# Altium schematic sheet Передатчик_2026-06-06.schdoc
size 391 x 151 mm
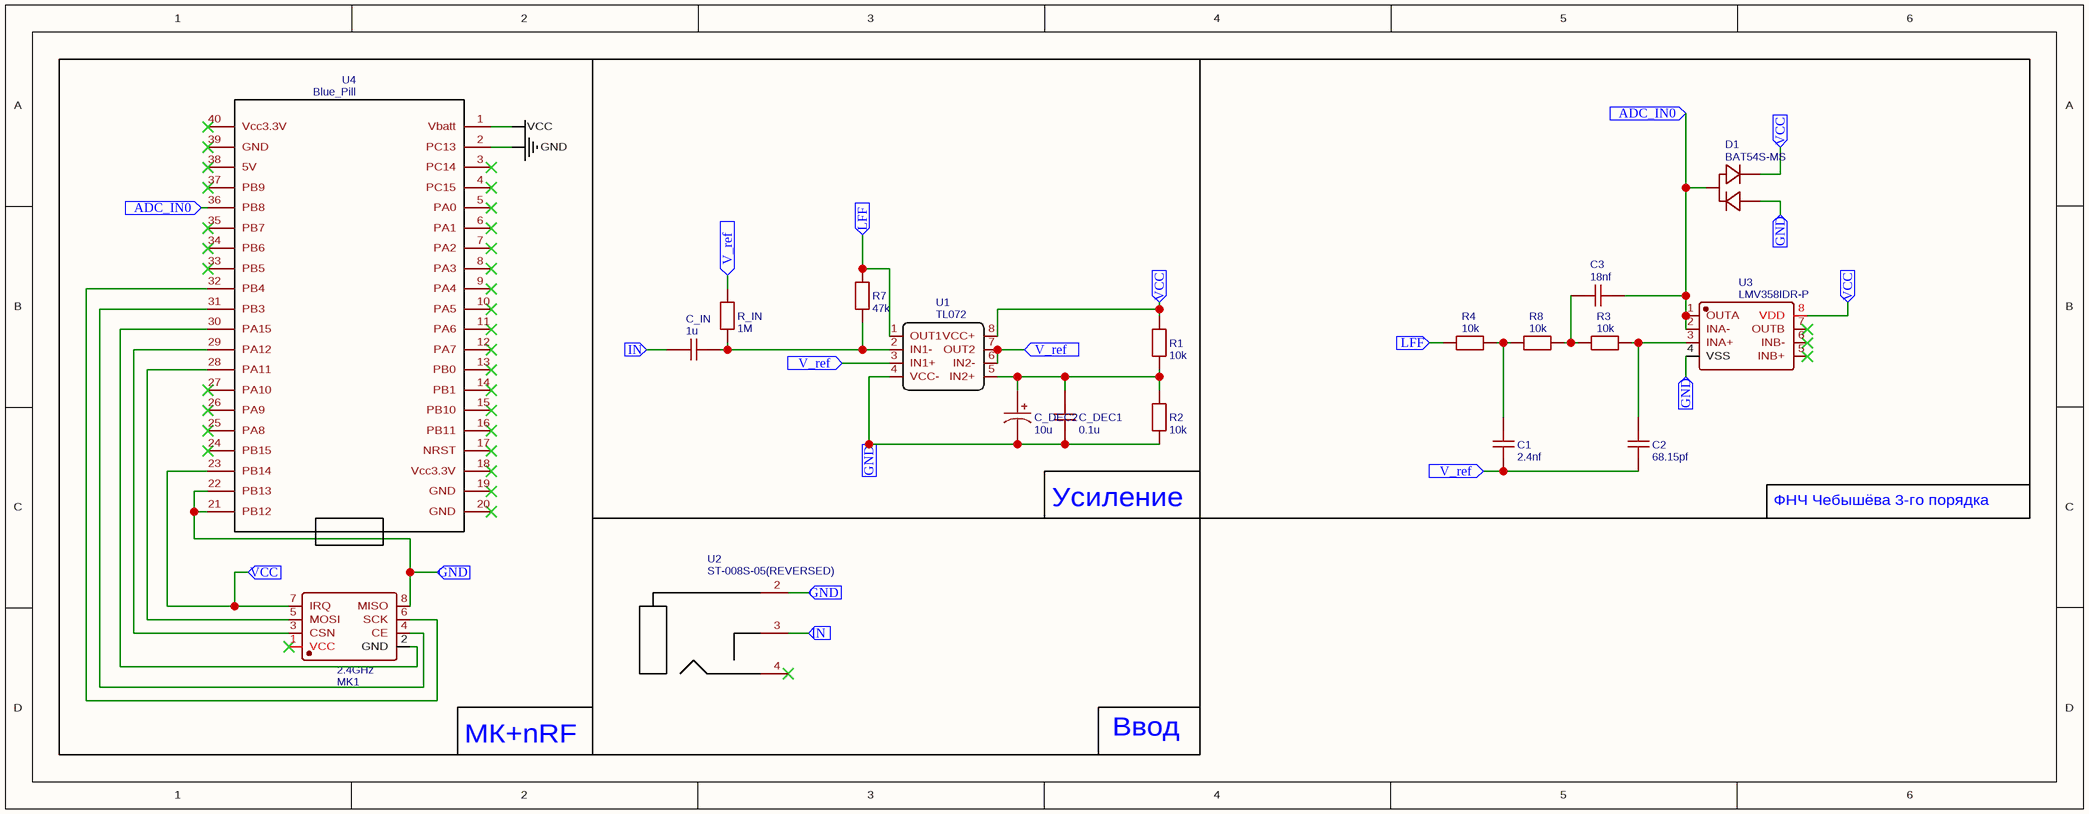
[diagram p0: Передатчик_2026-06-06.schdoc]

## Parts
C1  2.4nf  [C0603]
C2  68.15pf  [C0603]
C3  18nf  [C0603]
C_DEC1  0.1u  [C0603]
C_DEC2  10u  [CAP-D3.0×F1.5]
C_IN  1u  [C0603]
D1  BAT54S-MS  [SOT-23-3_L2.9-W1.3-P1.90-LS2.4-BR]
MK1  2.4GHz  [WIRELM-SMD_L28.6-W15.3-P2.54_NRF24L01]
R1  10k  [R0603]
R2  10k  [R0603]
R3  10k  [R0603]
R4  10k  [R0603]
R7  47k  [R0603]
R8  10k  [R0603]
R_IN  1M  [R0603]
U1  TL072  [TL072]
U2  ST-008S-05(REVERSED)  [ST-008S-05(REVERSED)]
U3  LMV358IDR-P  [SOP-8_L4.9-W3.9-P1.27-LS6.0-BL]
U4  Blue_Pill  [STM32F103C8T6-BLUEPILL 1]

## Blocks framed on the sheet
МК+nRF: MK1 U4
ФНЧ Чебышёва 3-го порядка: C1-C3 D1 R3 R4 R8 U3

## Ports
ADC_IN0 (in), GND (in), IN (in), LFF (in), V_ref (in), VCC (in)

## Nets
GND: U4.2(PC13)
VCC: U4.1(Vbatt)
ADC_IN0: C3.1 D1.3(C/A) U3.1(OUTA) U3.2(INA-) U4.36(PB8) ; port ADC_IN0
GND: C_DEC1.1 C_DEC2.2 D1.1(A) MK1.8(MISO) R2.2 U1.4(VCC-) U2.2 U3.4(VSS) U4.21(PB12) U4.22(PB13) ; port GND  [a separate net that carries the same name]
IN: C_IN.1 U2.3 ; port IN
LFF: R4.1 R7.2 U1.1(OUT1) ; port LFF
V_ref: C1.1 C2.1 R_IN.2 U1.3(IN1+) U1.6(IN2-) U1.7(OUT2) ; port V_ref
VCC: D1.2(C) MK1.7(IRQ) R1.1 U1.8(VCC+) U3.8(VDD) U4.23(PB14) ; port VCC  [a separate net that carries the same name]
NetC1_2: C1.2 R4.2 R8.1
NetC2_2: C2.2 R3.2 U3.3(INA+)
NetC3_2: C3.2 R3.1 R8.2
NetC_DEC1_2: C_DEC1.2 C_DEC2.1 R1.2 R2.1 U1.5(IN2+)
NetC_IN_2: C_IN.2 R7.1 R_IN.1 U1.2(IN1-)
NetMK1_2: MK1.2(GND) U4.30(PA15)
NetMK1_3: MK1.3(CSN) U4.29(PA12)
NetMK1_4: MK1.4(CE) U4.31(PB3)
NetMK1_5: MK1.5(MOSI) U4.28(PA11)
NetMK1_6: MK1.6(SCK) U4.32(PB4)

Not connected (* = marked no-connect by the designer): MK1 1(VCC)*; U2 4*; U3 5(INB+)* 6(INB-)* 7(OUTB)*; U4 3(PC14)* 4(PC15)* 5(PA0)* 6(PA1)* 7(PA2)* 8(PA3)* 9(PA4)* 10(PA5)* 11(PA6)* 12(PA7)* 13(PB0)* 14(PB1)* 15(PB10)* 16(PB11)* 17(NRST)* 18(Vcc3.3V)* 19(GND)* 20(GND)* 24(PB15)* 25(PA8)* 26(PA9)* 27(PA10)* 33(PB5)* 34(PB6)* 35(PB7)* 37(PB9)* 38(5V)* 39(GND)* 40(Vcc3.3V)*

## Notes on the sheet
- Усиление
- Ввод

## Library data of the parts
C1 = 2.4nf: nameAlias: Value(F); Contributor: LCEDA_Lib; spicePre: C; spiceSymbolName: C_0603_US
C2 = 68.15pf: nameAlias: Value(F); Contributor: LCEDA_Lib; spicePre: C; spiceSymbolName: C_0603_US
C3 = 18nf: nameAlias: Value(F); Contributor: LCEDA_Lib; spicePre: C; spiceSymbolName: C_0603_US
C_DEC1 = 0.1u: nameAlias: Value(F); Contributor: LCEDA_Lib; spicePre: C; spiceSymbolName: C_0603_US
C_DEC2 = 10u: nameAlias: Value(F); Contributor: LCEDA_Lib; spicePre: C; spiceSymbolName: CE_TH_D3.0×F1.5_US
C_IN = 1u: nameAlias: Value(F); Contributor: LCEDA_Lib; spicePre: C; spiceSymbolName: C_0603_US
D1 = BAT54S-MS: Manufacturer: MSKSEMI(美森科); Contributor: lcsc; Supplier: LCSC; Supplier Part: C2847018; Manufacturer Part: BAT54S-MS; JLCPCB Part Class: Extended Part; spicePre: D; spiceSymbolName: BAT54S-MS
MK1 = 2.4GHz: Manufacturer: Ai-Thinker(安信可); Manufacturer Part: NF-04; nameAlias: Value; Supplier: LCSC; Supplier Part: C90751; JLCPCB Part Class: Extended Part; spicePre: M; spiceSymbolName: NRF24L01
R1-R4 R8 = 10k: nameAlias: Value(Ω); Contributor: LCEDA_Lib; spicePre: R; spiceSymbolName: R_0603_EU
R7 = 47k: nameAlias: Value(Ω); Contributor: LCEDA_Lib; spicePre: R; spiceSymbolName: R_0603_EU
R_IN = 1M: nameAlias: Value(Ω); Contributor: LCEDA_Lib; spicePre: R; spiceSymbolName: R_0603_EU
U1 = TL072: Contributor: dmitrukvoloda; spicePre: U; spiceSymbolName: TL072
U2 = ST-008S-05(REVERSED): Contributor: danik_mus; spicePre: U; spiceSymbolName: ST-008S-05(REVERSED)
U3 = LMV358IDR-P: Manufacturer: TECH PUBLIC(台舟); Contributor: LCSC; Supplier: LCSC; Supplier Part: C2928703; Manufacturer Part: LMV358IDR; JLCPCB Part Class: Extended Part; spicePre: U; spiceSymbolName: LMV358IDR-P
U4 = Blue_Pill: Manufacturer Part: STM32Duino; Contributor: gianpysurf; spicePre: U; spiceSymbolName: Blue_Pill